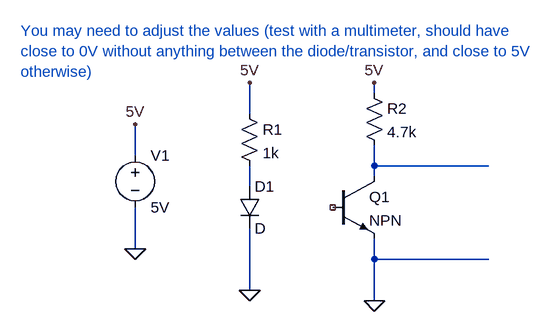
[diagram p0: schematic circuit.asc]
circuit.asc, the LTspice schematic file:
Version 4
SHEET 1 880 680
WIRE 256 0 256 -16
WIRE 64 32 64 -16
WIRE -112 96 -112 48
WIRE 256 112 256 80
WIRE 432 112 256 112
WIRE 256 128 256 112
WIRE 64 144 64 112
WIRE -112 240 -112 176
WIRE 256 256 256 224
WIRE 432 256 256 256
WIRE 64 304 64 208
WIRE 256 320 256 256
FLAG 64 -16 5V
FLAG 64 304 0
FLAG 256 320 0
FLAG 256 -16 5V
FLAG -112 48 5V
FLAG -112 240 0
SYMBOL diode 48 144 R0
SYMATTR InstName D1
SYMBOL res 48 16 R0
SYMATTR InstName R1
SYMATTR Value 1k
SYMBOL voltage -112 80 R0
WINDOW 123 0 0 Left 2
WINDOW 39 0 0 Left 2
SYMATTR InstName V1
SYMATTR Value 5V
SYMBOL npn 192 128 R0
SYMATTR InstName Q1
SYMBOL res 240 -16 R0
SYMATTR InstName R2
SYMATTR Value 4.7k
TEXT -288 -96 Left 2 ;You may need to adjust the values (test with a multimeter, should have\nclose to 0V without anything between the diode/transistor, and close to 5V\notherwise)

The netlist it stands for:
* circuit.asc
D1 N002 0 D
R1 5V N002 1k
V1 5V 0 5V
Q1 N001 NC_01 0 0 NPN
R2 5V N001 4.7k
.model D D
.lib standard.dio
.model NPN NPN
.model PNP PNP
.lib standard.bjt
* You may need to adjust the values (test with a multimeter, should have
* close to 0V without anything between the diode/transistor, and close to 5V
* otherwise)
.backanno
.end